# Altium schematic sheet STEP-UP.SchDoc: =DocumentName
size A4; CompanyName: "AS Manufacturing" LLC; Organization: "AS Manufacturing" LLC; Address1: 5 Sklyarenka St.; Address2: Kyiv 04073; Address3: Ukraine; Address4: https://ajax.systems/en/; DocumentNumber: 2; SheetNumber: 2; SheetTotal: 7; Template_version: 1.0.1
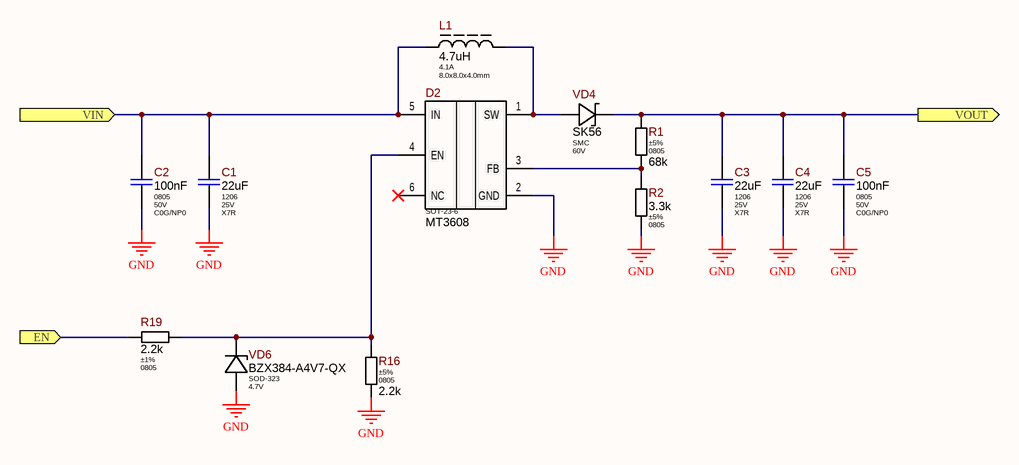
[diagram p0: STEP-UP.SchDoc]

## Parts
C1  Package: 1206  Voltage: 25V  Dielectric Type: X7R  [C_CERAMIC_1206_MED]  (hidden comment: 22uF)
C2  Package: 0805  Voltage: 50V  Dielectric Type: C0G/NP0  [C_CERAMIC_0805_HI]  (hidden comment: 100nF)
C3  Package: 1206  Voltage: 25V  Dielectric Type: X7R  [C_CERAMIC_1206_MED]  (hidden comment: 22uF)
C4  Package: 1206  Voltage: 25V  Dielectric Type: X7R  [C_CERAMIC_1206_MED]  (hidden comment: 22uF)
C5  Package: 0805  Voltage: 50V  Dielectric Type: C0G/NP0  [C_CERAMIC_0805_HI]  (hidden comment: 100nF)
D2  Package: SOT-23-6  [MT3608_MED]  (hidden comment: MT3608)
L1  Current: 4.1A  Package: 8.0x8.0x4.0mm  [SWPA8040S-Series]  (hidden comment: 4.7uH)
R1  Tolerance: ±5%  Package: 0805  [R_ANY_CHIP_0805_MED]  (hidden comment: 68k)
R2  Tolerance: ±5%  Package: 0805  [R_ANY_CHIP_0805_MED]  (hidden comment: 3.3k)
R16  Tolerance: ±5%  Package: 0805  [R_ANY_CHIP_0805_MED]  (hidden comment: 2.2k)
R19  Tolerance: ±1%  Package: 0805  [R_ANY_CHIP_0805_MED]  (hidden comment: 2.2k)
VD4  Voltage: 60V  [SMC]  (hidden comment: SK56)
VD6  Package: SOD-323  Voltage: 4.7V  [SOD-323_MED]  (hidden comment: BZX384-A4V7-QX)

## Ports
EN (in), VIN (in), VOUT (out)

## Nets
GND: C1.2 C2.2 C3.2 C4.2 C5.2 D2.2(GND) R2.2 R16.2 VD6.AN
EN: R19.1 ; port EN
VIN: C1.1 C2.1 D2.5(IN) L1.1 ; port VIN
VOUT: C3.1 C4.1 C5.1 R1.1 VD4.CA ; port VOUT
NetD2_1: D2.1(SW) L1.2 VD4.AN
NetD2_3: D2.3(FB) R1.2 R2.1
NetD2_4: D2.4(EN) R16.1 R19.2 VD6.CA

Not connected (* = marked no-connect by the designer): D2 6(NC)*

## Notes on the sheet
- Title
- Product:
- Project:
- Size:
- Date:
- Variant:
- A4
- Authors:
- Time:
- Sheet
- of
- Revision:
- @Vitech_ua
- Commit:

## Library data of the parts
C1 C3 C4 = 1206B102K102CG: 22uF 25V; Part Number: CL31A226KAHNNNE; Manufacturer: SAMSUNG; Standard Lead Time: 31 Weeks; Component Status: Released; Tolerance: ±10%; Replacement: NONE; Value: 22uF; Part Type: Ceramic / X7R / 1206; Component Type: SMD; Temperature Range: -55°C ~ 125°C; ComponentLink1URL: https://eu.mouser.com/datasheet/2/210/Middle_and_High_Voltage_DS-1535659.pdf; Supplier 1: Mouser; Supplier Part Number 1: 791-1206B102K102CT; Price: 0; ComponentLink1Description: Datasheet
C2 C5 = CERAMIC_0805: Part Number: **; Manufacturer: Hitano; Component Status: Released; Tolerance: ±5%; Replacement: NONE; GUID_1C: 32087c8a-96b8-11ea-ab61-0050569f2651; Part Type: Ceramic / C0G(NP0) / 0402; Component Type: SMD; Temperature Range: -55°C ~ 125°C; ComponentLink1URL: \\altiumdb.ajax.local\files\Datasheet\Capacitor\Hitano-MLCC.pdf; Price: 0; ComponentLink1Description: Datasheet; Value: 100nF
D2 = MT3608: 2V-24V Input High Efficiency 1.2MHz 2A Step Up Converter; Manufacturer: Aerosemi; Ajax_1C_ID: 8101; Ajax_1C_PN: MT3608 Aerosemi 2A Step Up Converter IC SOT-23-6; Ajax_1С_Status: Mass Production; Standard Lead Time: NONE; Component Status: Released; GUID_1C: 8b925ac5-fc04-11e5-817b-d8cb8a9acc66; Part Number: MT3608; Lifecycle: Not Recommended; Part Type: Power / DC-DC / Boost; Component Type: SMD; Temperature Range: -40°C ~ 85°C; ComponentLink1URL: https://www.olimex.com/Products/Breadboarding/BB-PWR-3608/resources/MT3608.pdf; Replacement: NONE; Price: 0,12; ComponentLink1Description: Datasheet
L1 = SWPA8040S4R7NT: 4.7uH Magnetic-Resin Shielded Wirewound Inductor 4.1 A 25mOhm Max; Manufacturer: Shenzhen Sunlord Electronics; Ajax_1C_ID: 85672; Ajax_1C_PN: 4.7uH 30% 4.1A 25mOhm Max SWPA8040S4R7NT SMD Power Inductor; Ajax_1С_Status: RND Only; Saturation Current: 5.9A; Tolerance: ±30%; Component Status: Released; Standard Lead Time: 16 Weeks; Replacement: NONE; GUID_1C: 9a5367f7-7c8d-11ee-a921-00505699469b; Value: 4.7uH; Part Number: SWPA8040S4R7NT; Part Type: Power / Ferrite Core; Component Type: SMD; Temperature Range: -40°C ~ 125°C; ComponentLink1URL: \\altiumdb.ajax.local\files\Datasheet\Inductors\SWPA_Series_of_SMD_Power_Inductor.pdf; Supplier 1: Digi-Key; Supplier Part Number 1: 3442-SWPA8040S4R7NTTR-ND; Price: 0,83075; ComponentLink1Description: Datasheet
R1 R16 = RC0805JR-072K2L: 2.2 kOhms ±5% 1/8W 0805 Thick Film Resistor; Manufacturer: Yageo; Ajax_1C_ID: 26119; Ajax_1C_PN: 2.2k 5% 0805 Resistors SMD RoHS; Ajax_1С_Status: RND Only; Power Rating: 0.125W; Voltage: 150V; Component Status: Released; Temperature Stability: ±100ppm/°C; Replacement: NONE; GUID_1C: 80325ec8-617a-11eb-ab6f-0050569f2651; Part Number: RC0805JR-072K2L; Component Type: SMD; Part Type: Thick Film; Temperature Range: -55°C ~ 155°C; ComponentLink1URL: https://eu.mouser.com/datasheet/2/447/PYu_RC_Group_51_RoHS_L_11-1984063.pdf; Supplier 1: Digi-Key; Supplier Part Number 1: 311-2.2KARTR-ND; ComponentLink1Description: Datasheet
  R1: Value: 68k; Price: 0,005
  R16: Value: 2.2k; Price: 0.0011
R2 = RC0805JR-073K3L: 3.3 kOhms ±5%, 1/8W 0805 Thick Film Resistor; Manufacturer: Yageo; Ajax_1C_ID: 9030; Ajax_1C_PN: 3.3k 5% 0805 Resistors SMD RoHS; Ajax_1С_Status: RND Only; Power Rating: 0.125W; Voltage: 150V; Component Status: Released; Temperature Stability: ±100ppm/°C; Replacement: NONE; GUID_1C: cb9785ec-9b47-11e6-8242-d8cb8a9acc66; Value: 3.3k; Part Number: RC0805JR-073K3L; Component Type: SMD; Part Type: Thick Film; Temperature Range: -55°C ~ 155°C; ComponentLink1URL: https://eu.mouser.com/datasheet/2/447/PYu_RC_Group_51_RoHS_L_10-1664068.pdf; Price: 0,001081; ComponentLink1Description: Datasheet
R19 = RC0805FR-072K2L: 2.2 kOhms ±1% 1/8W 0805 Thick Film Resistor; Manufacturer: Yageo; Ajax_1C_ID: 30906; Ajax_1C_PN: 2.2k 1% 0805 Resistors SMD RoHS; Ajax_1С_Status: RND Only; Power Rating: 0.125W; Voltage: 150V; Component Status: Released; Temperature Stability: ±100ppm/°C; Replacement: NONE; GUID_1C: 690422a9-c9eb-11eb-ab74-0050569f2651; Value: 2.2k; Part Number: RC0805FR-072K2L; Component Type: SMD; Part Type: Thick Film; Temperature Range: -55°C ~ 155°C; ComponentLink1URL: https://eu.mouser.com/datasheet/2/447/YAGEO_PYu_RC_Group_51_RoHS_L_12-3313492.pdf; Supplier 1: Mouser; Supplier Part Number 1: 603-RC0805FR-072K2L; Price: 0.0014; ComponentLink1Description: Datasheet
VD4 = SS34: Diode Schottky 60V 5A, SMC; Manufacturer: KLS; Component Status: Released; Standard Lead Time: 14 Weeks; Current: 3A; Vf: 500mV @ 3A; Replacement: NONE; Part Number: SK56; Package: SMC; Part Type: Schottky; Component Type: SMD; Marking: SK56; Temperature Range: -55°C ~ 150°C; Supplier 1: Digi-Key; Supplier Part Number 1: SS34FSCT-ND; Price: 0.03; ComponentLink1Description: Datasheet
VD6 = BZX384-A4V7-QX: Zener Diode 4.7V, 300mW, ±1%, Leakage 3uA @ 2V, SOD-323; Manufacturer: Nexperia USA; Ajax_1C_PN: NONE; Ajax_1С_Status: RND Only; Marking: 22; Component Status: Released; Standard Lead Time: 4 Weeks; Part Number: BZX384-A4V7-QX; Part Type: Zener; Component Type: SMD; Temperature Range: -65°C ~ 150°C; ComponentLink1URL: https://eu.mouser.com/datasheet/2/916/BZX384_Q_SER-2721638.pdf; Supplier 1: Mouser; Supplier Part Number 1: 771-BZX384-A4V7-QX; Replacement: NONE; Price: NONE; ComponentLink1Description: Datasheet